# Altium schematic sheet motherboard_ERC.SchDoc
size A2; SheetNumber: 1; SheetTotal: 1
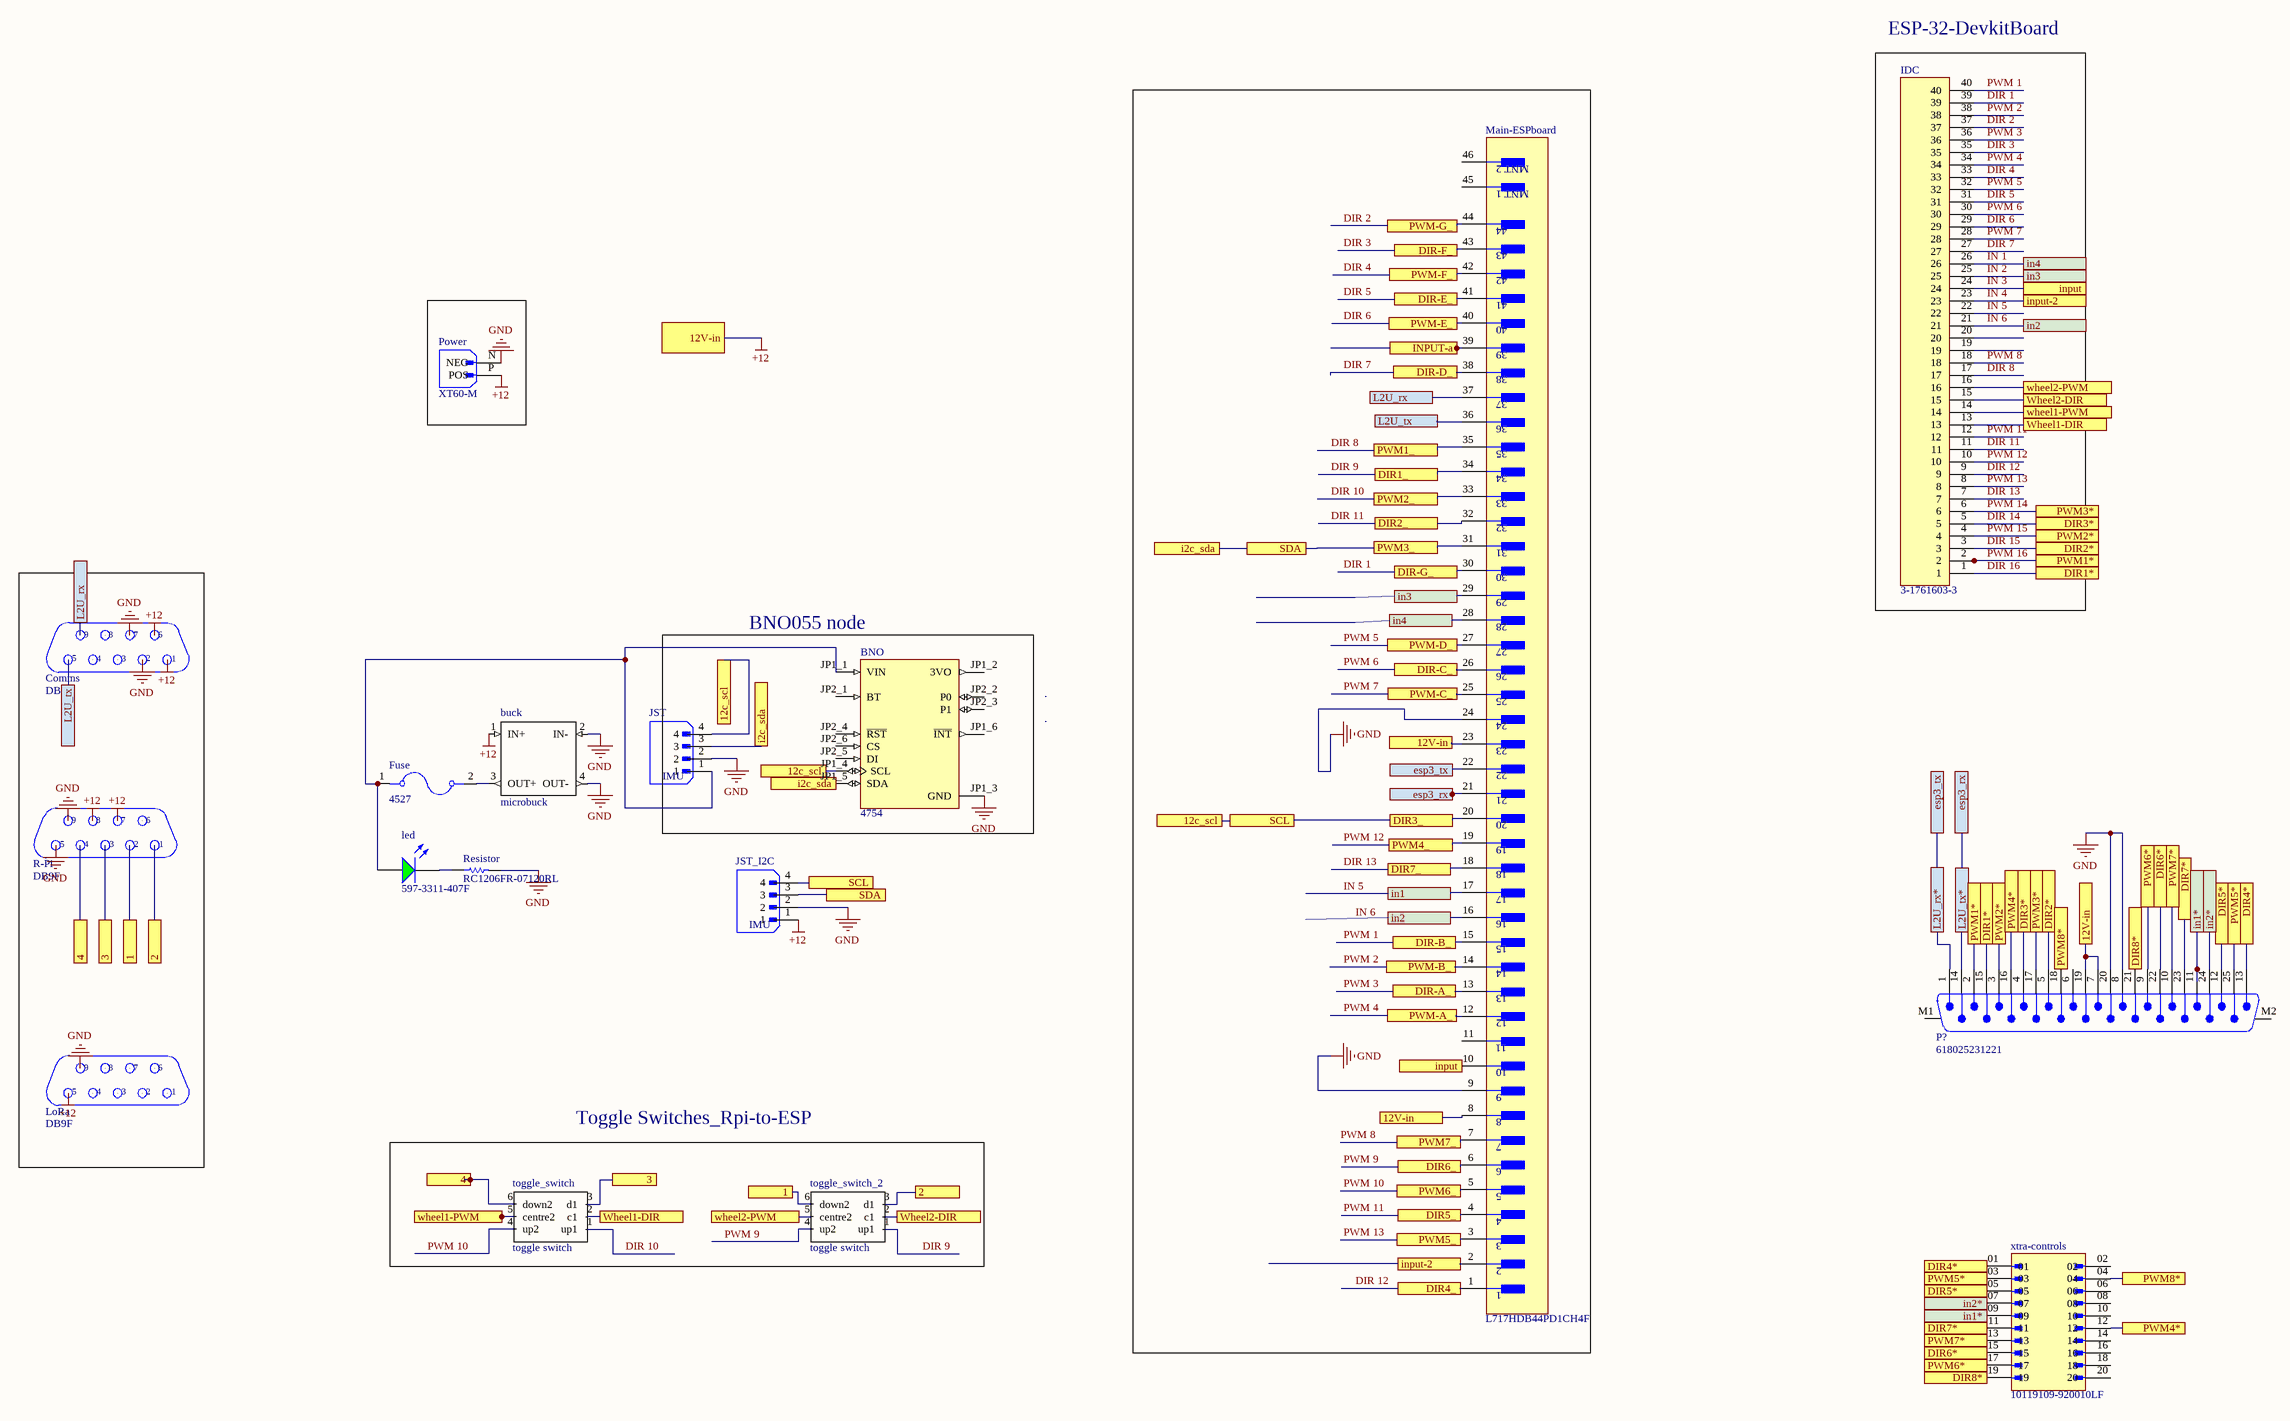
[diagram p0: motherboard_ERC.SchDoc]

## Parts
BNO  4754  [MODULE_4754]
buck  microbuck  [Micro buck]
Comms  DB9F  [D-09F]
Fuse  4527  [FUSE_4527]
IDC  3-1761603-3  [TE_3-1761603-3]
JST  IMU  [JST_B4B-EH-A]
JST_I2C  IMU  [JST_B4B-EH-A]
led  597-3311-407F  [DIAL-597-3311-407F_V]
LoRa  DB9F  [D-09F]
Main-ESPboard  L717HDB44PD1CH4F  [FP-L717HDB44PD1CH4F-MFG]
P?  618025231221  [618025231221]
Power  XT60-M  [AMASS_XT60-M]
R-Pi  DB9F  [D-09F]
Resistor  RC1206FR-07120RL  [RESC3116X65X40LL10T20]
toggle_switch  toggle switch  [toggle switch]
toggle_switch_2  toggle switch  [toggle switch]
xtra-controls  10119109-920010LF  [AMPHENOL_10119109-920010LF]

## Blocks framed on the sheet
ESP-32-DevkitBoard: IDC
BNO055 node: BNO JST
Toggle Switches_Rpi-to-ESP: toggle_switch toggle_switch_2

## Ports
1, 2, 3, 4, 12c_scl, 12V-in, DIR1*, DIR1_, DIR2*, DIR2_, DIR3*, DIR3_, DIR4*, DIR4_, DIR5*, DIR5_, DIR6*, DIR6_, DIR7*, DIR7_, DIR8*, DIR-A_, DIR-B_, DIR-C_, DIR-D_, DIR-E_, DIR-F_, DIR-G_, esp3_rx, esp3_tx, i2c_sda, in1, in1*, in2, in2*, in3, in4, input, input-2, INPUT-a, L2U_rx, L2U_rx*, L2U_tx, L2U_tx*, PWM1*, PWM1_, PWM2*, PWM2_, PWM3*, PWM3_, PWM4*, PWM4_, PWM5*, PWM5_, PWM6*, PWM6_, PWM7*, PWM7_, PWM8*, PWM-A_, PWM-B_, PWM-C_, PWM-D_, PWM-E_, PWM-F_, PWM-G_, SCL, SDA, Wheel1-DIR, wheel1-PWM, Wheel2-DIR, wheel2-PWM

## Nets
+12: buck.1(IN+) Comms.1 Comms.6 JST_I2C.1 LoRa.5 Main-ESPboard.8 Main-ESPboard.23 P?.7 P?.19 Power.P(POS) R-Pi.7 R-Pi.8 ; port 12V-in
GND: BNO.JP1_3(GND) buck.2(IN-) buck.4(OUT-) Comms.2 Comms.7 JST.2 JST_I2C.2 LoRa.9 Main-ESPboard.9 Main-ESPboard.24 P?.8 P?.20 Power.N(NEG) R-Pi.5 R-Pi.9 Resistor.2
1: R-Pi.2 toggle_switch_2.6(down2) ; port 1
2: R-Pi.1 toggle_switch_2.3(d1) ; port 2
3: R-Pi.3 toggle_switch.3(d1) ; port 3
4: R-Pi.4 toggle_switch.6(down2) ; port 4
12c_scl: BNO.JP1_4(SCL) JST.4 JST_I2C.4 Main-ESPboard.20 ; port 12c_scl, port DIR3_, port SCL
DIR4*: P?.13 xtra-controls.01 ; port DIR4*
DIR5*: P?.12 xtra-controls.05 ; port DIR5*
DIR6*: P?.22 xtra-controls.15 ; port DIR6*
DIR7*: P?.23 xtra-controls.11 ; port DIR7*
DIR8*: P?.21 xtra-controls.19 ; port DIR8*
DIR 1: IDC.39 Main-ESPboard.30 ; port DIR-G_
DIR 2: IDC.37 Main-ESPboard.44 ; port PWM-G_
DIR 3: IDC.35 Main-ESPboard.43 ; port DIR-F_
DIR 4: IDC.33 Main-ESPboard.42 ; port PWM-F_
DIR 5: IDC.31 Main-ESPboard.41 ; port DIR-E_
DIR 6: IDC.29 Main-ESPboard.40 ; port PWM-E_
DIR 7: IDC.27 Main-ESPboard.38 ; port DIR-D_
DIR 8: IDC.17 Main-ESPboard.35 ; port PWM1_
DIR 9: Main-ESPboard.34 toggle_switch_2.1(up1) ; port DIR1_
DIR 10: Main-ESPboard.33 toggle_switch.1(up1) ; port PWM2_
DIR 11: IDC.11 Main-ESPboard.32 ; port DIR2_
DIR 12: IDC.9 Main-ESPboard.1 ; port DIR4_
DIR 13: IDC.7 Main-ESPboard.18 ; port DIR7_
DIR 14: IDC.5 P?.4 ; port DIR3*
DIR 15: IDC.3 P?.5 ; port DIR2*
DIR 16: IDC.1 P?.15 ; port DIR1*
esp3_rx: Main-ESPboard.21 P?.14 ; port L2U_tx*, port esp3_rx
esp3_tx: Main-ESPboard.22 P?.1 ; port L2U_rx*, port esp3_tx
i2c_sda: BNO.JP1_5(SDA) JST.3 JST_I2C.3 Main-ESPboard.31 ; port i2c_sda, port PWM3_, port SDA
in1*: P?.11 xtra-controls.09 ; port in1*
in2*: P?.24 xtra-controls.07 ; port in2*
IN 1: IDC.26 Main-ESPboard.28 ; port in4
IN 2: IDC.25 Main-ESPboard.29 ; port in3
IN 3: IDC.24 Main-ESPboard.10 ; port input
IN 4: IDC.23 Main-ESPboard.2 ; port input-2
IN 5: IDC.22 Main-ESPboard.17 ; port in1
IN 6: IDC.21 Main-ESPboard.16 ; port in2
INPUT-a: Main-ESPboard.39 ; port INPUT-a
L2U_rx: Comms.9 Main-ESPboard.37 ; port L2U_rx
L2U_tx: Comms.5 Main-ESPboard.36 ; port L2U_tx
PWM4*: P?.16 xtra-controls.12 ; port PWM4*
PWM5*: P?.25 xtra-controls.03 ; port PWM5*
PWM6*: P?.9 xtra-controls.17 ; port PWM6*
PWM7*: P?.10 xtra-controls.13 ; port PWM7*
PWM8*: P?.18 xtra-controls.04 ; port PWM8*
PWM 1: IDC.40 Main-ESPboard.15 ; port DIR-B_
PWM 2: IDC.38 Main-ESPboard.14 ; port PWM-B_
PWM 3: IDC.36 Main-ESPboard.13 ; port DIR-A_
PWM 4: IDC.34 Main-ESPboard.12 ; port PWM-A_
PWM 5: IDC.32 Main-ESPboard.27 ; port PWM-D_
PWM 6: IDC.30 Main-ESPboard.26 ; port DIR-C_
PWM 7: IDC.28 Main-ESPboard.25 ; port PWM-C_
PWM 8: IDC.18 Main-ESPboard.7 ; port PWM7_
PWM 9: Main-ESPboard.6 toggle_switch_2.4(up2) ; port DIR6_
PWM 10: Main-ESPboard.5 toggle_switch.4(up2) ; port PWM6_
PWM 11: IDC.12 Main-ESPboard.4 ; port DIR5_
PWM 12: IDC.10 Main-ESPboard.19 ; port PWM4_
PWM 13: IDC.8 Main-ESPboard.3 ; port PWM5_
PWM 14: IDC.6 P?.17 ; port PWM3*
PWM 15: IDC.4 P?.3 ; port PWM2*
PWM 16: IDC.2 P?.2 ; port PWM1*
Wheel1-DIR: IDC.13 toggle_switch.2(c1) ; port Wheel1-DIR
wheel1-PWM: IDC.14 toggle_switch.5(centre2) ; port wheel1-PWM
Wheel2-DIR: IDC.15 toggle_switch_2.2(c1) ; port Wheel2-DIR
wheel2-PWM: IDC.16 toggle_switch_2.5(centre2) ; port wheel2-PWM
NetBNO_JP1_1: BNO.JP1_1(VIN) Fuse.1 JST.1 led.1(A)
Netbuck_3: buck.3(OUT+) Fuse.2
Netled_2: led.2(K) Resistor.1

Not connected (* = marked no-connect by the designer): BNO JP1_2(3VO) JP1_6(~{INT}) JP2_1(BT) JP2_2(P0) JP2_3(P1) JP2_4(~{RST}) JP2_5(DI) JP2_6(CS); Comms 3 4 8; IDC 19 20; LoRa 1 2 3 4 6 7 8; Main-ESPboard 11 45(MNT_1) 46(MNT_2); P? 6 M1 M2; R-Pi 6; xtra-controls 02 06 08 10 14 16 18 20

## Notes on the sheet
- Labels drawn without touching a wire or pin: IN 6

## Library data of the parts
BNO = 4754: Adafruit 9-DOF Orientation IMU Fusion Breakout - BNO085 (BNO080) - STEMMA QT / Qwiic; MP: 4754; SnapEDA_Link: https://www.snapeda.com/parts/4754/Adafruit+Industries/view-part/?ref=snap; Price: None; Purchase-URL: https://pricing.snapeda.com/search/part/4754/?ref=eda; MF: Adafruit; Package: None; Availability: In Stock; Check_prices: https://www.snapeda.com/parts/4754/Adafruit+Industries/view-part/?ref=eda; Value: *
Comms LoRa R-Pi = DB9F: Adapter Connector D-Sub, 9 Pin Female To Modular, Female Jack, 8p8c _RJ45_ Beige; MF: Assmann WSW; SnapEDA_Link: https://www.snapeda.com/parts/DB9F/Assmann%20WSW%20Components/view-part/558712/?ref=snap; MP: DB9F; Availability: Unavailable; Price: None; Value: *; Package: None
Fuse = 4527: Fuseholder; 5 A; 250 V; Nylon; Base only; Brass, Tin Plate (Contact); Value: *; MP: 4527; Package: None; Availability: Unavailable; Price: None
IDC = 3-1761603-3: AMP-LATCH 40 Position 2.54 mm Dual Row Through-Hole Straight Pin Header; Centerline_Pitch: 2.54 mm[.1 in]; Number_of_Positions: 40; MF: TE Connectivity; Product_Type: Connector; MP: 3-1761603-3; SnapEDA_Link: https://www.snapeda.com/parts/3-1761603-3/TE%20Connectivity%20AMP%20Connectors/view-part/379325/?ref=snap; Value: *; Package: None; DigiKey-Purchase-URL: https://snapeda.com/shop?store=DigiKey&id=379325; Price: None; EU_RoHS_Compliance: Compliant; Availability: Unavailable
JST JST_I2C = B4B-EH-A: Connector Header Through Hole 4 position 0.098 (2.50mm); MF: JST; SnapEDA_Link: https://www.snapeda.com/parts/B4B-EH-A/JST/view-part/?ref=snap; Package: None; Value: *; MP: B4B-EH-A; Check_prices: https://www.snapeda.com/parts/B4B-EH-A/JST/view-part/?ref=eda
led = CMP-2000-05651-1: LED Green, 75 mW, 30 mA, -30 to 85 degC, 2-Pin SMD, RoHS, Tape and Reel; Manufacturer: Dialight; Product Depth (mm): 1.5mm; Viewing Angle: 70deg; DELETED: Compliant; Number of  Elements: 1; Emitting Color: YellowGreen; Shape Type: Rectangular; Product Length (mm): 3mm; Forward Current: 30mA; Main Category: ChipLED; Luminous Intensity: 7.5mcd; High Brightness: No; Test Current (It): 20mA; Lens Type: NonDiffused; Reverse Voltage: 4V; Peak Wavelength: 560nm; Power Dissipation: 75W; Forward Voltage: 2.5V; Chip Material: GaP; Mounting: SurfaceMount; Product Height (mm): 1.5mm; Pin Count: 2; Type: Uni-Color; Datasheet URL: https://datasheet.ciiva.com/15117/getdatasheetpartid-142484-15117764.pdf; Mounting Technology: SurfaceMount; Rad Hardened: No; Operating Temperature Classification: Commercial; Lens Dimensions: 2x1.5x0.9mm; Operating Temp Range: -30Cto85C; Package Reference: 597-3311-407F; Package Type: SMD; Datasheet Version: 07/2002; Lum Intensity: 7.5mcd; Packaging: TapeandReel; Package Description: 2-Pin Surface Mount Device, Body 1.5 x 3 mm; Manufacturer URL: http://www.dialight.com/
Main-ESPboard = CMP-02362-000001-1: CONN DSUB HD PLUG 44POS R/A SLDR; Current Rating: 3A; Body Material: Steel; Number of Contacts: 44; Connector Type: D-Sub; Number of Ports: 1; Gender: Male; Voltage Rating: 250V; Width: 12.55mm; Contact Plating: Gold; Max Operating Temperature: 105°C; Number of Terminals: 44; Length: 53.09mm; Number of Rows: 3; Number of Positions: 44; Min Operating Temperature: -55°C; Orientation: Right Angle; Packaging: Tray; Package Quantity: 50; Termination: Solder; Depth: 22.22mm; Housing Material: Thermoplastic; Mount: Through Hole; Contact Material: Brass
P? = CMP-1502-00286-2: NexarPartId: 18818208; Operating Supply Voltage: 125V; Number of Contacts: 25; Current Rating: 3A; Insulation Resistance: 5GΩ; Gender: Male; Pitch: 2.77mm; Contact Resistance: 30mΩ; Mount: Through Hole; REACH SVHC: Unknown; Depth: 18.5mm; Orientation: Right Angle; Length: 53.1mm; RoHS: Compliant; Contact Plating: Gold; Insulation Material: PBT; Termination: SMD/SMT; Min Operating Temperature: -55°C; Voltage Rating: 125V; Number of Pins: 25; Housing Material: Steel; Max Operating Temperature: 105°C; Number of Rows: 2; Width: 12.5mm
Power = XT60-M: Plug; DC supply; XT60; male; PIN: 2; for cable; soldered; 30A; 500V; MF: AMASS; SnapEDA_Link: https://www.snapeda.com/parts/XT60-M/AMASS/view-part/?ref=snap; Package: Package; Value: *; MP: XT60-M; Check_prices: https://www.snapeda.com/parts/XT60-M/AMASS/view-part/?ref=eda
Resistor = CMP-2000-06965-1: Chip Resistor, 120 Ohm, +/- 1%, 250 mW, -55 to 155 degC, 1206 (3216 Metric), RoHS, Tape and Reel; Manufacturer: Yageo; Resistor Element Type: ThickFilm; Resistance: 120ohm; Voltage Rating: 200V; Temperature Coefficient: ±100ppm/°C; Power Rating: 250mW; Product Range: RCSeries; SVHC: ToBeAdvised; Resistor Case Style: 1206[3216Metric]; Package Reference: 1206; Resistance Tolerance: ±1%; Package Description: 2-Pin Surface Mount Device, Body 3.1 x 1.6 mm; Manufacturer URL: http://www.yageo.com/; MSL: MSL1-Unlimited; Packaging: CutTape; Datasheet URL: http://www.yageo.com/documents/recent/PYu-RC_Group_51_RoHS_L_7.pdf; Mounting Technology: SurfaceMount; Datasheet Version: Rev. 7, 05/2017
xtra-controls = 10119109-920010LF: MF: Amphenol; Availability: In Stock; Check_prices: https://www.snapeda.com/parts/10119109-920010LF/Amphenol/view-part/?ref=eda; SnapEDA_Link: https://www.snapeda.com/parts/10119109-920010LF/Amphenol/view-part/?ref=snap; MP: 10119109-920010LF; Price: None; Purchase-URL: https://pricing.snapeda.com/search/part/10119109-920010LF/?ref=eda; Package: None; Value: *